# EasyEDA Pro project ProPrj_基于STM32的多功能串口分析仪_2025-03-12.epro, schematic H750_1

## Sheets
1 MUC: Board Name: V2.1.0_1; Create Date: 2025-02-20; Page Name: MUC; Project Name: 基于STM32的多功能串口分析仪; Schematic Name: H750_1; Update Date: 2025-03-08; Company: 嘉立创EDA; Page Size: A4; Version: V1.0
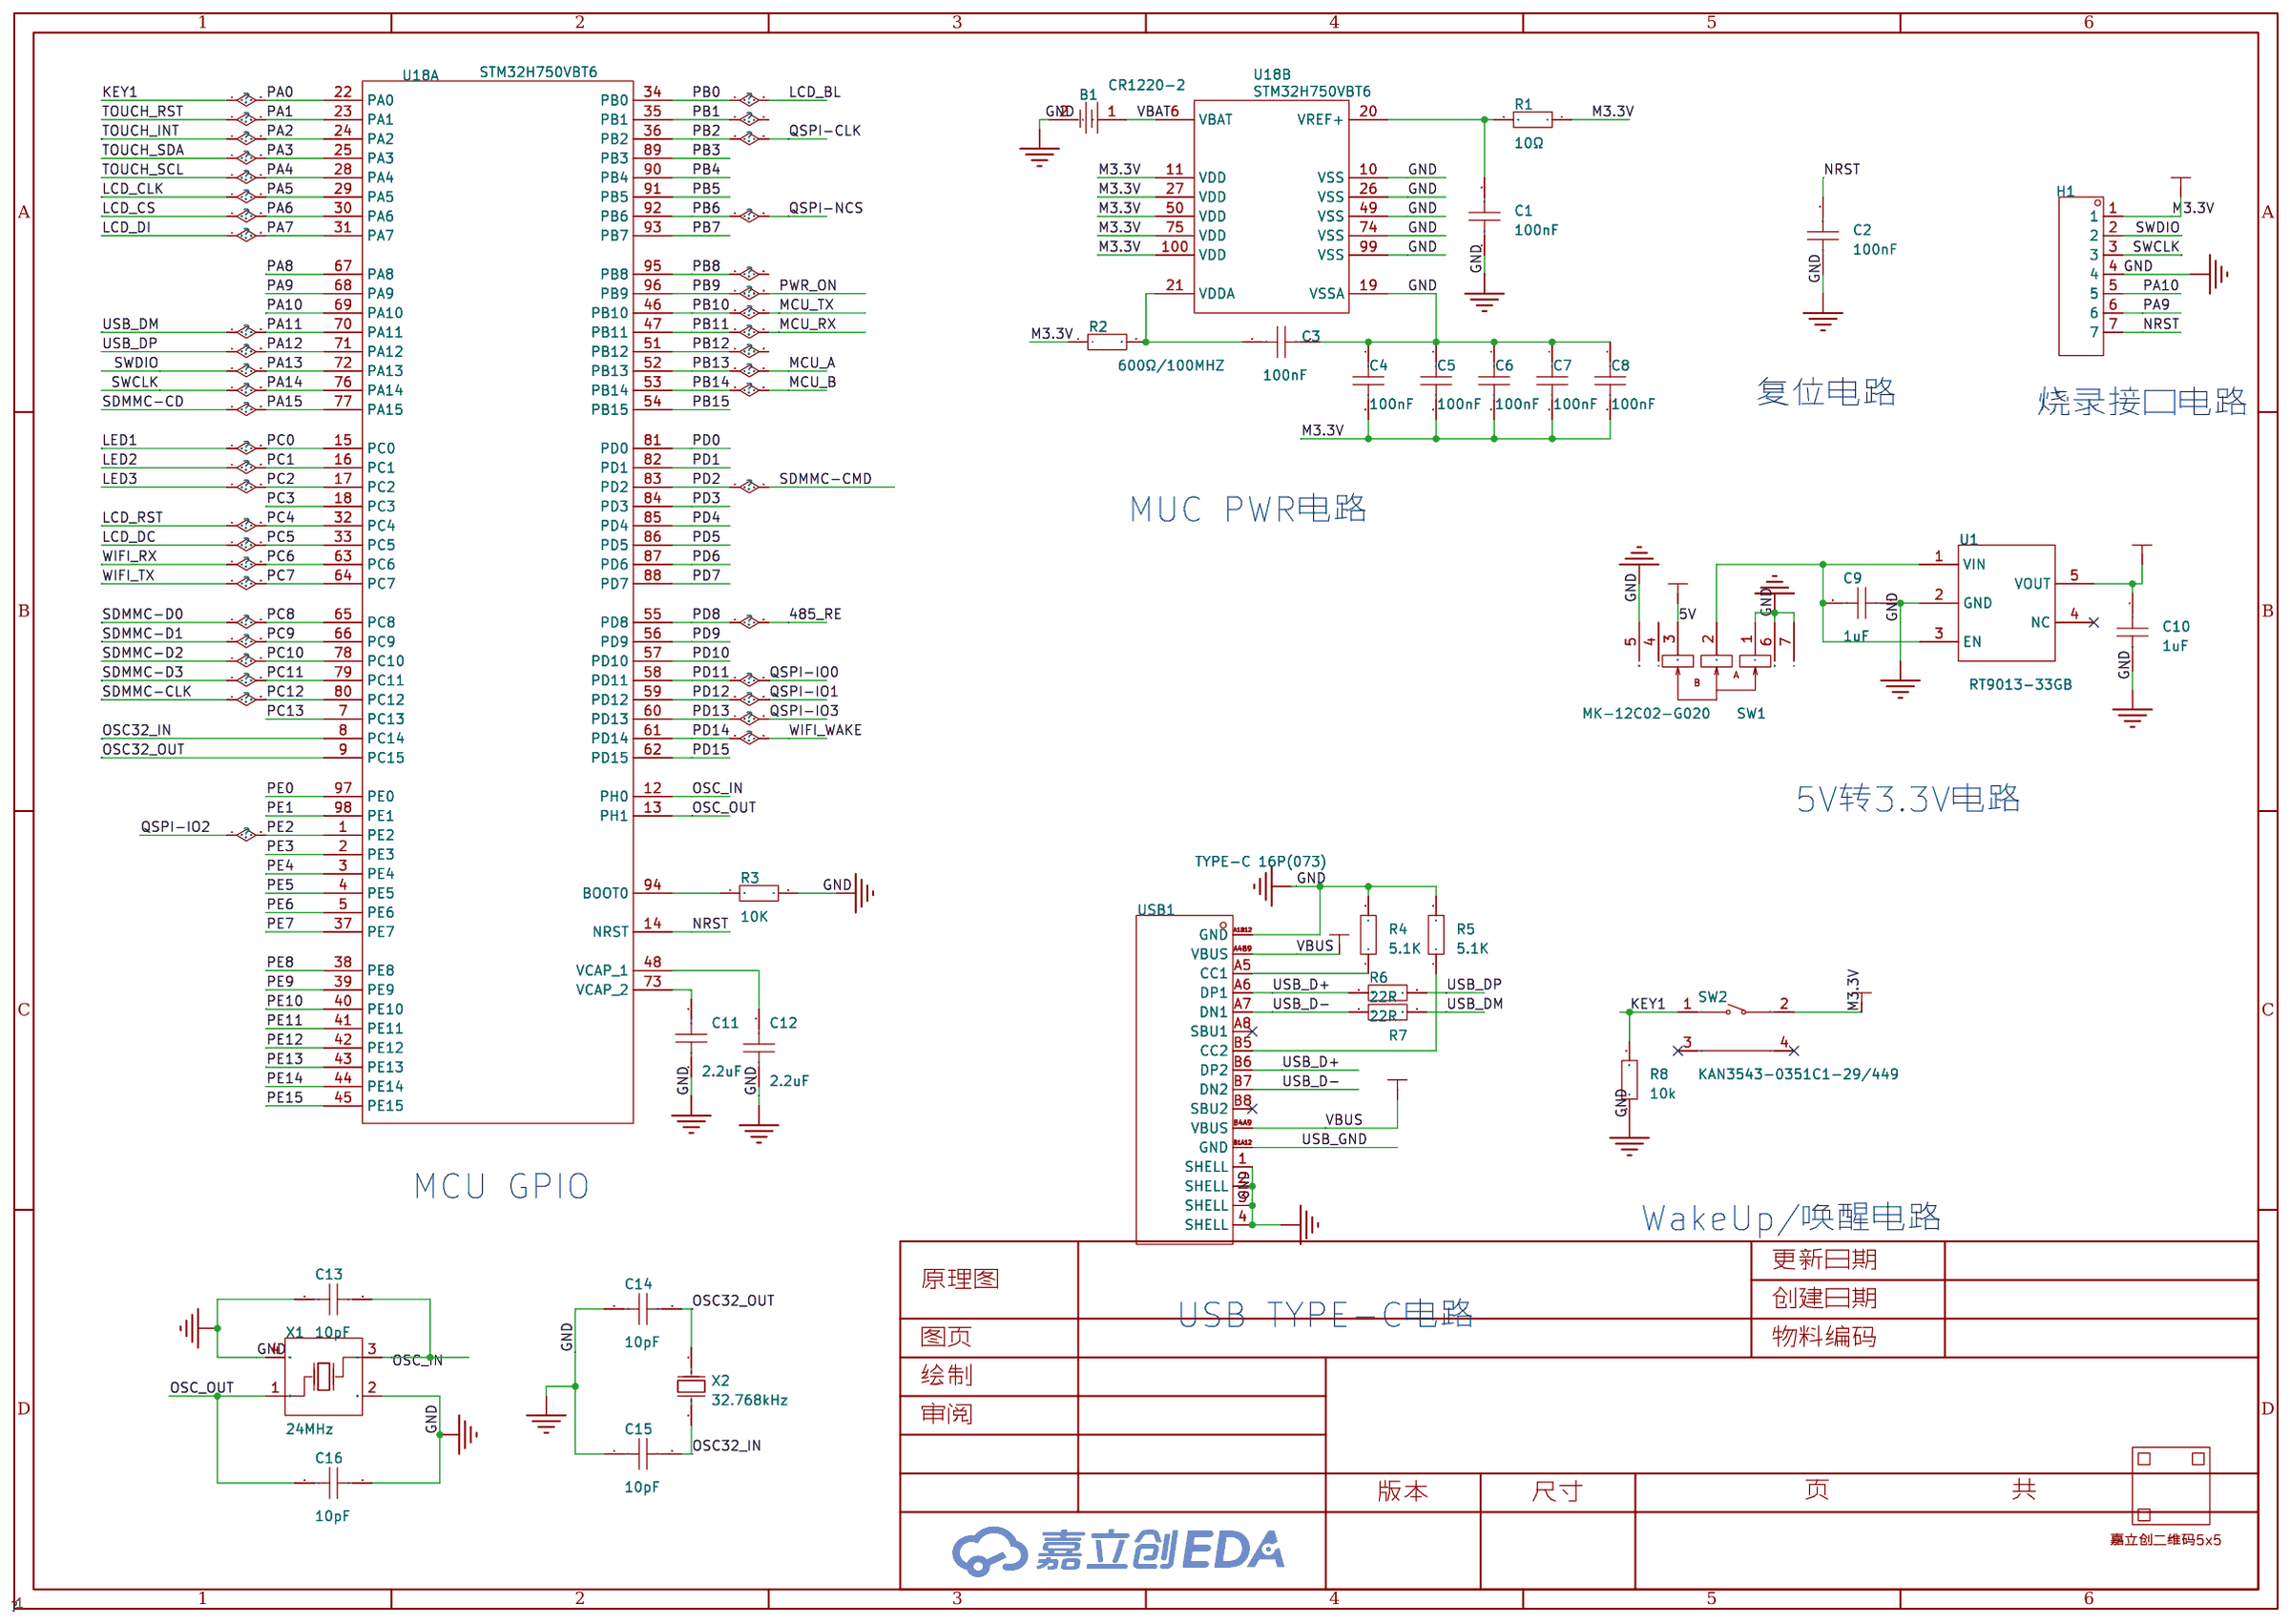
[diagram p3: MUC]
2 HardWare: Page Name: HardWare
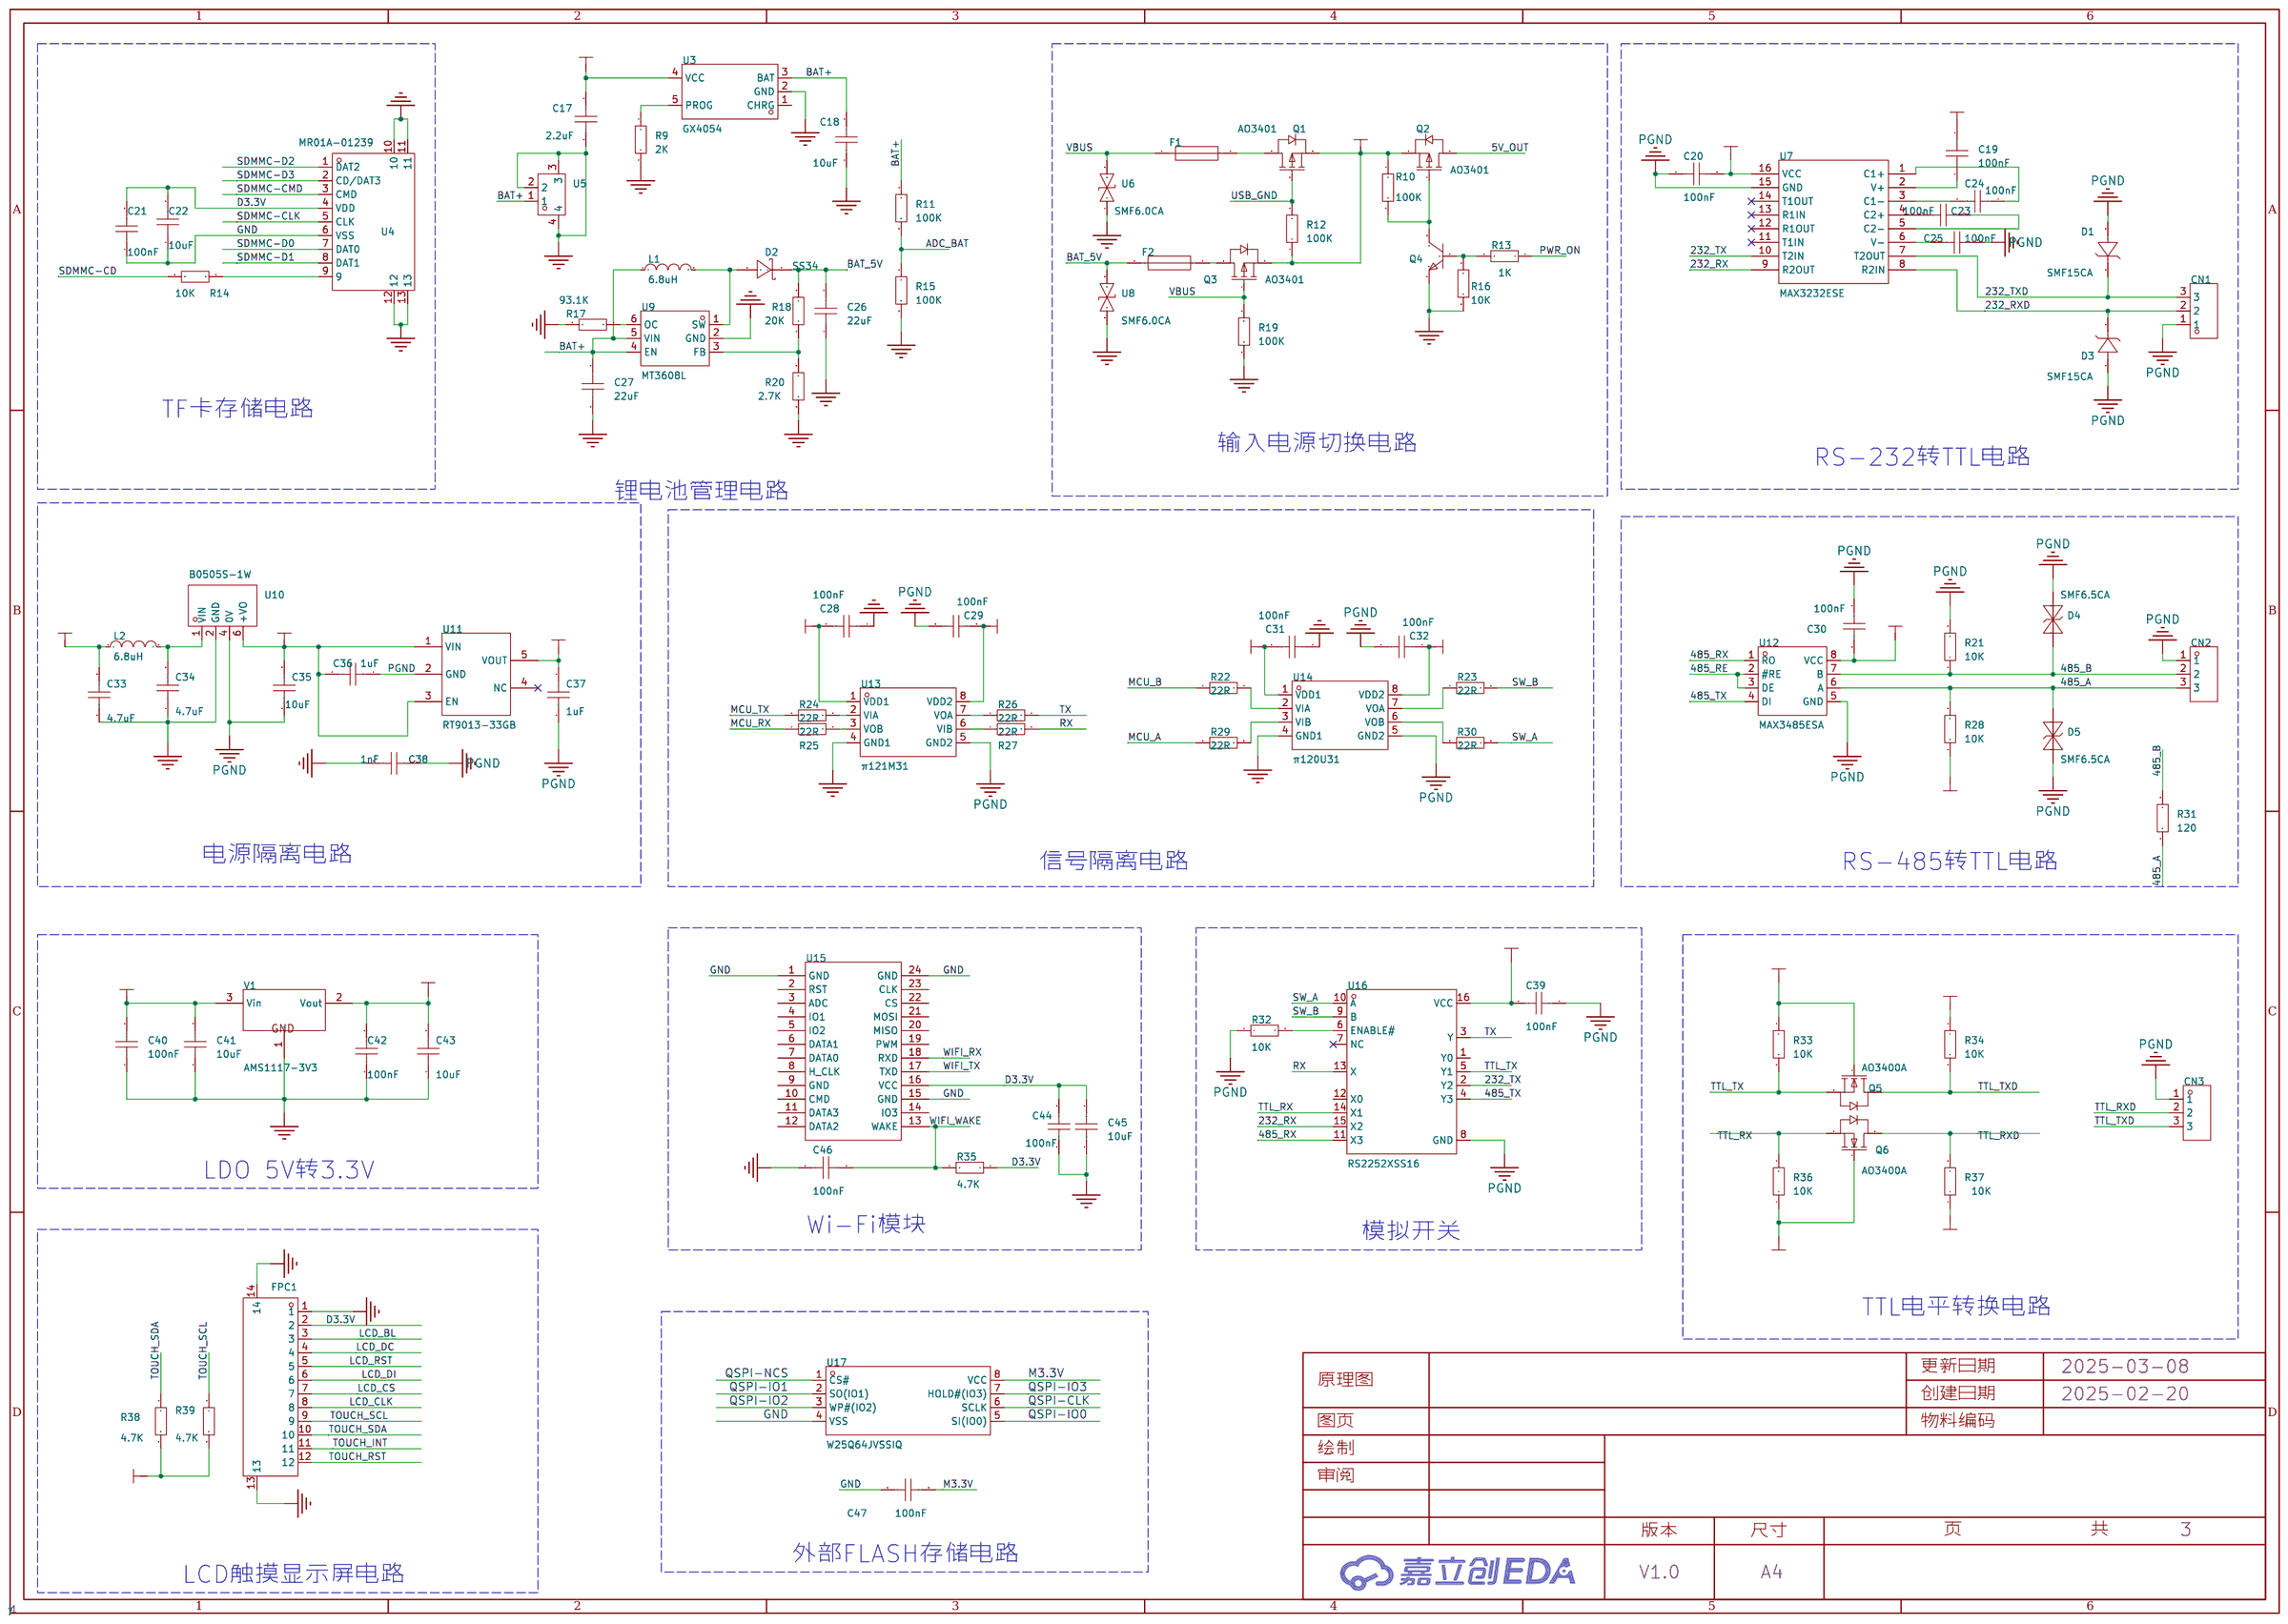
[diagram p4: HardWare]

## Parts
sheet HardWare
C17  2.2uF  [C0603]
C18  10uF  [C0603]
C19  100nF  [C0603]
C20  100nF  [C0603]
C21  100nF  [C0603]
C22  10uF  [C0603]
C23  100nF  [C0603]
C24  100nF  [C0603]
C25  100nF  [C0603]
C26  22uF  [C0805]
C27  22uF  [C0805]
C28  100nF  [C0603]
C29  100nF  [C0603]
C30  100nF  [C0603]
C31  100nF  [C0603]
C32  100nF  [C0603]
C33  4.7uF  [C0603]
C34  4.7uF  [C0603]
C35  10uF  [C0603]
C36  1uF  [C0603]
C37  1uF  [C0603]
C38  1nF  [C0603]
C39  100nF  [C0603]
C40  100nF  [C0603]
C41  10uF  [C0603]
C42  100nF  [C0603]
C43  10uF  [C0603]
C44  100nF  [C0603]
C45  10uF  [C0603]
C46  100nF  [C0603]
C47  100nF  [C0603]
CN1  DB2ERC-3.81-3P-GN  [CONN-TH_3P-P3.81_DB2ERC-3.81-3P]
CN2  DB2ERC-3.81-3P-GN  [CONN-TH_3P-P3.81_DB2ERC-3.81-3P]
CN3  DB2ERC-3.81-3P-GN  [CONN-TH_3P-P3.81_DB2ERC-3.81-3P]
D1  SMF15CA  [SOD-123FL_L2.7-W1.8-LS3.8-RD]
D2  SS34  [SMA_L4.3-W2.6-LS5.0-RD]
D3  SMF15CA  [SOD-123FL_L2.7-W1.8-LS3.8-RD]
D4  SMF6.5CA  [SOD-123FL_L2.7-W1.8-LS3.8-BI]
D5  SMF6.5CA  [SOD-123FL_L2.7-W1.8-LS3.8-BI]
F1  BSMD0805-010-33V  [F0805]
F2  BSMD0805-010-33V  [F0805]
FPC1  FPC-05F-12PH20  [FPC-SMD_12P-P0.50_FPC-05F-12PH20]
L1  6.8uH  [IND-SMD_L2.5-W2.0_FHD252010S-6R8MT]
L2  6.8uH  [IND-SMD_L2.5-W2.0_FHD252010S-6R8MT]
Q1  AO3401  [SOT-23-3_L2.9-W1.4-P1.90-LS2.6-BR]
Q2  AO3401  [SOT-23-3_L2.9-W1.4-P1.90-LS2.6-BR]
Q3  AO3401  [SOT-23-3_L2.9-W1.4-P1.90-LS2.6-BR]
Q4  -  [S8050_SOT-23]
Q5  AO3400A  [SOT-23-3_L2.9-W1.3-P1.90-LS2.4-BR]
Q6  AO3400A  [SOT-23-3_L2.9-W1.3-P1.90-LS2.4-BR]
R9  2K  [R0603]
R10  100K  [R0603]
R11  100K  [R0603]
R12  100K  [R0603]
R13  1K  [R0603]
R14  10K  [R0603]
R15  100K  [R0603]
R16  10K  [R0603]
R17  93.1K  [R0603]
R18  20K  [R0603]
R19  100K  [R0603]
R20  2.7K  [R0603]
R21  10K  [R0603]
R22  22R  [R0603]
R23  22R  [R0603]
R24  22R  [R0603]
R25  22R  [R0603]
R26  22R  [R0603]
R27  22R  [R0603]
R28  10K  [R0603]
R29  22R  [R0603]
R30  22R  [R0603]
R31  120  [R0603]
R32  10K  [R0603]
R33  10K  [R0603]
R34  10K  [R0603]
R35  4.7K  [R0603]
R36  10K  [R0603]
R37  10K  [R0603]
R38  4.7K  [R0603]
R39  4.7K  [R0603]
U3  GX4054  [SOT-23-5_L2.9-W1.6-P0.95-LS2.8-BR]
U4  MR01A-01239  [TF-SMD_MR01A-01211]
U5  ZX-XH2.54-2PLT  [BAT+]
U6  SMF6.0CA  [SOD-123FL_L2.8-W1.8-LS3.7-BI]
U7  MAX3232ESE  [SOIC-16_L9.9-W3.9-P1.27-LS6.0-BL]
U8  SMF6.0CA  [SOD-123FL_L2.8-W1.8-LS3.7-BI]
U9  MT3608L  [SOT-23-6_L2.9-W1.6-P0.95-LS2.8-BL_3]
U10  B0505S-1W  [PWRM-TH_B0505S-3WR2]
U11  RT9013-33GB  [SOT-23-5_L3.0-W1.7-P0.95-LS2.8-BL]
U12  MAX3485ESA  [SOP-8_L5.0-W4.0-P1.27-LS6.0-BL]
U13  π121M31  [SOIC-8_L5.0-W4.0-P1.27-LS6.0-BL]
U14  π120U31  [soic-8_l5.0-w4.0-p1.27-ls6.0-bl]
U15  -  [E103-W11]
U16  RS2252XSS16  [SSOP-16_L4.9-W3.9-P0.635-LS6.0-BL]
U17  W25Q64JVSSIQ  [SOP-8_L5.3-W5.3-P1.27-LS8.0-BL]
V1  AMS1117-3V3  [SOT89-3_HOUSING_REVA_02SEP2012]
sheet MUC
B1  CR1220-2  [BAT-SMD_CR1220-2]
C1  100nF  [C0603]
C2  100nF  [C0603]
C3  100nF  [C0603]
C4  100nF  [C0603]
C5  100nF  [C0603]
C6  100nF  [C0603]
C7  100nF  [C0603]
C8  100nF  [C0603]
C9  1uF  [C0603]
C10  1uF  [C0603]
C11  2.2uF  [C0603]
C12  2.2uF  [C0603]
C13  10pF  [C0603]
C14  10pF  [C0603]
C15  10pF  [C0603]
C16  10pF  [C0603]
H1  -  [HDR-TH_7P-P2.54-V-F]
R1  10Ω  [R0603]
R2  600Ω/100MHZ  [R0603]
R3  10K  [R0603]
R4  5.1K  [R0603]
R5  5.1K  [R0603]
R6  22R  [R0603]
R7  22R  [R0603]
R8  10k  [R0603]
SW1  MK-12C02-G020  [SW-SMD_MK-12C02-G020]
SW2  KAN3543-0351C1-29/449  [SW-SMD_GANGYUAN_KAN3543-0351C1]
U1  RT9013-33GB  [SOT-23-5_L3.0-W1.7-P0.95-LS2.8-BL]
U2  -  [JLC-QRCODE-5x5]
U18  STM32H750VBT6  [LQFP-100_L14.0-W14.0-P0.50-LS16.0-BL]  (sections 1,2)
USB1  TYPE-C 16P(073)  [USB-C-SMD_TYPE-C16PIN_C668624]
X1  24MHz  [CRYSTAL-SMD_4P-L3.2-W2.5-BL]
X2  32.768kHz  [CRYSTAL-SMD_L3.2-W1.5-1]

## Library data of the parts
C1-C25 C28-C47 = CAP_0603: Supplier Footprint: 0603
C26 C27 = CAP_0805: Supplier Footprint: 0805
CN1-CN3 = DB2ERC-3.81-3P-GN: 连接器类型:板端/插座-闭口;结构:1x3P;间距:3.81mm;颜色:绿色;安装方式:弯针;排数:1;每排PIN数:3;额定电流:10A;额定电压:250V;工作温度范围:-40℃~+105℃;; LCSC Part Name: 3.81mm 1x3P 排数:1 每排P数:3; Supplier Part: C395690; Manufacturer: DORABO(地博电气); Supplier Footprint: 弯插,P=3.81mm; Datasheet: https://atta.szlcsc.com/upload/public/pdf/source/20221115/4E217E7D538220F8720C137D6A05E519.pdf; Supplier: LCSC; Connector Type: 板端/插座-闭口; Structure: 1x3P; Pitch: 3.81mm; Color: 绿色; Mounting Style: 弯针; Number of Pins: 3P; Number of Rows: 1; Number of PINs Per Row: 3; Current Rating (Max): 10A; Voltage Rating (Max): 250V; Operating Temperature Range: -40℃~+105℃
D1 D3 = SMF16CA_C19077511: 极性:双向;反向截止电压(Vrwm):16V;最大钳位电压:26V;峰值脉冲电流(Ipp)@10/1000us:7.7A;峰值脉冲功率(Ppp)@10/1000us:200W;击穿电压:17.8V;; LCSC Part Name: SMF16CA; Supplier Part: C19077511; Manufacturer: 宏迦橙; Supplier Footprint: SOD-123FL; Datasheet: https://atta.szlcsc.com/upload/public/pdf/source/20231129/4813F17DC56F8B344A8D004597B3633C.pdf; Supplier: LCSC; polarity: 双向; Reverse Stand-Off Voltage (Vrwm): 16V; Maximum Clamping Voltage: 26V; Peak Pulse Current (Ipp)@10/1000us: 7.7A; Peak Pulse Power Dissipation (Ppp)@10/1000us: 200W; Breakdown Voltage: 17.8V; Reverse Leakage Current (Ir): 1uA; Number of Lines: 单路; Operating Temperature: -55℃~+155℃; Type: TVS
D2 = SS34: Supplier Part: C9900023345; Supplier Footprint: SMA,DO-214AC; JLCPCB Part Class: 扩展库; Supplier: LCSC
D4 D5 = SMF6.5CA_C19077501: 极性:双向;反向截止电压(Vrwm):6.5V;最大钳位电压:11.2V;峰值脉冲电流(Ipp)@10/1000us:17.9A;峰值脉冲功率(Ppp)@10/1000us:200W;击穿电压:7.22V;; Supplier Part: C19077501; Manufacturer: 宏迦橙; Supplier Footprint: SOD-123FL; Datasheet: https://atta.szlcsc.com/upload/public/pdf/source/20231201/BA209EB353689BD2A9785188AB9E10B0.pdf; Supplier: LCSC; polarity: 双向; Reverse Stand-Off Voltage (Vrwm): 6.5V; Maximum Clamping Voltage: 11.2V; Peak Pulse Current (Ipp)@10/1000us: 17.9A; Peak Pulse Power Dissipation (Ppp)@10/1000us: 200W; Breakdown Voltage: 7.22V; Reverse Leakage Current (Ir): 1uA; Number of Lines: 单路; Operating Temperature: -55℃~+155℃; Type: TVS
F1 F2 = BSMD0805-010-33V: 最大电压:33V;最大电流:40A;保持电流:100mA;跳闸电流:300mA;; LCSC Part Name: 0805 0.1A 33V 国产高电压; Supplier Part: C883101; Manufacturer: BHFUSE(佰宏); Supplier Footprint: 0805; Datasheet: https://atta.szlcsc.com/upload/public/pdf/source/20230512/7A46D6CD923C15CBB98FD769C08EDD80.pdf; Supplier: LCSC; Operating Voltage (Max): 33V; Current Rating (Max): 40A; Hold Current: 100mA; Trip Current: 300mA; Power Dissipation: 500mW; Resistance - Initial (Ri) (Min): 750mΩ; Resistance - Post Trip (R1) (Max): 6Ω; Maximum Time to Trip: 1.5s; Operating Temperature: -40℃~+85℃
FPC1 = FPC-05F-12PH20: 锁定特性:翻盖式;触点类型:下接;触点数量:12P;间距:0.5mm;安装类型:卧贴;工作温度范围:-25℃~+85℃;; LCSC Part Name: 间距:0.5mm P数:12P 翻盖式 下接; Supplier Part: C2856799; Manufacturer: XUNPU(讯普); Supplier Footprint: SMD,P=0.5mm,卧贴; Datasheet: https://atta.szlcsc.com/upload/public/pdf/source/20210922/C2856799_794322F63241F1C59819430844B946BA.pdf; Supplier: LCSC; Locking Feature: 翻盖式; Contact Type: 下接; Number of Contacts: 12P; Pitch: 0.5mm; Mounting Type: 卧贴; FFC, FCB Thickness: 0.3mm; Height Above Board: 2mm; Operating Temperature Range: -25℃~+85℃
L1 L2 = FHD252010S-6R8MT: 电感值:6.8uH;精度:±20%;额定电流:1A;饱和电流(Isat):1.15A;; LCSC Part Name: 6.8uH ±20% 1.15A; Supplier Part: C602006; Manufacturer: cjiang(长江微电); Supplier Footprint: 1008; Datasheet: https://atta.szlcsc.com/upload/public/pdf/source/20200609/C601990_BCEA243EC4DA0A9A288AA78A6DFB48A5.pdf; Supplier: LCSC; Tolerance: ±20%; Rated Current: 1A; Saturation Current (Isat): 1.15A; DC Resistance (DCR): 380mΩ
Q1-Q3 = AO3401_C727156: 类型:1个P沟道;漏源电压(Vdss):30V;连续漏极电流(Id):4.2A;功率(Pd):350mW;导通电阻(RDS(on)@Vgs,Id):65mΩ@10V,4.2A;阈值电压(Vgs(th)@Id):1.3V@250uA;; LCSC Part Name: 1个P沟道 耐压:30V 电流:4.2A; Supplier Part: C727156; Manufacturer: TWGMC(台湾迪嘉); Supplier Footprint: SOT-23; Datasheet: https://atta.szlcsc.com/upload/public/pdf/source/20200827/C727156_6E081BBEEFBC6B8FEE164CB196B0AF30.pdf; Supplier: LCSC; Type: 1个P沟道; Drain Source Voltage (Vdss): 30V; Continuous Drain Current (Id): 4.2A; Power Dissipation (Pd): 350mW; Drain Source On Resistance (RDS(on)@Vgs,Id): 65mΩ@10V,4.2A; Gate Threshold Voltage (Vgs(th)@Id): 1.3V@250uA
Q4 = S8050_SOT_NPN: Supplier Footprint: SOT-23
Q5 Q6 = AO3400A_C347475: 类型:1个N沟道;漏源电压(Vdss):30V;连续漏极电流(Id):5.8A;功率(Pd):1.4W;导通电阻(RDS(on)@Vgs,Id):35mΩ@10V,5.8A;阈值电压(Vgs(th)@Id):1.4V@250uA;; LCSC Part Name: 1个N沟道 耐压:30V 电流:5.8A; Supplier Part: C347475; Manufacturer: UMW(友台半导体); Supplier Footprint: SOT-23; Datasheet: https://atta.szlcsc.com/upload/public/pdf/source/20231109/50AB4FB4D66E55864F9B8D027B723C9A.pdf; Supplier: LCSC; Type: 1个N沟道; Drain Source Voltage (Vdss): 30V; Continuous Drain Current (Id): 5.8A; Power Dissipation (Pd): 1.4W; Drain Source On Resistance (RDS(on)@Vgs,Id): 35mΩ@10V,5.8A; Gate Threshold Voltage (Vgs(th)@Id): 1.4V@250uA; Total Gate Charge (Qg@Vgs): 12nC@4.5V; Input Capacitance (Ciss@Vds): 1.05nF@15V; Operating Temperature: -55℃~+150℃@(Tj)
R1-R39 = Res_0603: Supplier Footprint: 0603
U3 = GX4054: 最大充电电流:500mA;; Supplier Part: C5259235; Manufacturer: 国芯佳品; Supplier Footprint: SOT-23-5L; JLCPCB Part Class: 扩展库; Datasheet: https://atta.szlcsc.com/upload/public/pdf/source/20231117/282E3D86D21E4B74B8836E6CF123CD3A.pdf; Supplier: LCSC; Maximum Charge Current: 500mA
U4 = MR01A-01239: LCSC Part Name: MICRO SD CARD PUSH 外焊型 带锁卡功能 功能区镀金3u″锡脚镀雾纯锡至少160u″卷装; Supplier Part: C2891857; Manufacturer: ATOM(爱特姆); Supplier Footprint: SMD; Datasheet: https://atta.szlcsc.com/upload/public/pdf/source/20220228/F2FB385E664216F5F9F5E4078ECAFC8D.pdf; Supplier: LCSC
U5 = ZX-XH2.54-2PLT: 插针结构:1x2P;间距:2.54mm;安装方式:立贴;参考系列:XH;总PIN数:2P;排数:1;每排PIN数:2;行距:-;额定电流:3A;触头材质:黄铜;触头镀层:锡;工作温度范围:-25℃~+85℃;; Supplier Part: C7429680; Manufacturer: Megastar(兆星); Supplier Footprint: SMD,P=2.54mm; Datasheet: https://atta.szlcsc.com/upload/public/pdf/source/20230619/87C018EBE425F10E4B035B436CF5FBBC.pdf; Supplier: LCSC; Pins Structure: 1x2P; Pitch: 2.54mm; Mounting Style: 立贴; Reference Series: XH; Number of Pins: 2P; Number of Rows: 1; Number of PINs Per Row: 2; Current Rating (Max): 3A; Contact Material: 黄铜; Contact Plating: 锡; Operating Temperature Range: -25℃~+85℃
U6 U8 = SMF6.0CA_C2990473: 反向截止电压(Vrwm):6V;最大钳位电压:10.3V;峰值脉冲电流(Ipp)@10/1000us:19.4A;峰值脉冲功率(Ppp)@10/1000us:200W;击穿电压:6.67V;; Supplier Part: C2990473; Manufacturer: Liown(里阳半导体); Supplier Footprint: SOD-123FL; Datasheet: https://atta.szlcsc.com/upload/public/pdf/source/20231227/BBF9EE757846DE4D601D73FF261316E0.pdf; Supplier: LCSC; Reverse Stand-Off Voltage (Vrwm): 6V; Maximum Clamping Voltage: 10.3V; Peak Pulse Current (Ipp)@10/1000us: 19.4A; Peak Pulse Power Dissipation (Ppp)@10/1000us: 200W; Breakdown Voltage: 6.67V; Reverse Leakage Current (Ir): 400uA; Type: TVS
U7 = MAX3232ESE+T: 类型:收发器;驱动器/接收器:2/2;数据速率:250Kbps;; LCSC Part Name: 3.0V至5.5V、低功耗、1Mbps、真RS-232收发器; Supplier Part: C15846; Manufacturer: ADI(亚德诺)/MAXIM(美信); Supplier Footprint: SOIC-16; Datasheet: https://atta.szlcsc.com/upload/public/pdf/source/20220812/1D5DF2FF91750DFE63BD771071C0B1F6.pdf; Supplier: LCSC; Types: 收发器; Driver/receiver: 2/2; Data Rate: 250Kbps; Supply Voltage: 3V~5.5V; Operating Temperature: -40℃~+85℃
U9 = MT3608L: Supplier Part: C2932326; Manufacturer: 西安航天民芯; Supplier Footprint: SOT-23-6; Datasheet: https://atta.szlcsc.com/upload/public/pdf/source/20211213/953A62CC1033762E00AABAD4906DD7F1.pdf; Supplier: LCSC
U10 = B0505S-3WR2_C5369498: 支持100%全国产，B0505S-3WR2品是专门应用在分布式电源系统中需要产生一路与输入电源隔离的电源的应用场合而设计。该产品适用于：纯数字电路，一般低频模拟电路，继电器驱动电路，数据交换电路等输出电压15V，输出电流（mA）200，可持续 短路保护空载输入电流低至4mA效率高达85%低纹波系数和低噪音隔离电压 1500VDC国际标准引脚方式工作温度范围：-40℃ ~+105℃可根据客户需求设计特殊规格产品●; LCSC Part Name: DC-DC 输入电压4.5V~5.5V 输出电压5V输出功率3W600mA; Supplier Part: C5369498; Manufacturer: YLPTEC(易川); Supplier Footprint: SIP-4; Datasheet: https://atta.szlcsc.com/upload/public/pdf/source/20230417/78355FDB466A614ED9BF545F60A618F8.pdf; Supplier: LCSC
U1 U11 = RT9013-33GB: 输出类型:固定;最大输入电压:5.5V;输出电压:3.3V;最大输出电流:500mA;电源纹波抑制比(PSRR):50dB@(10kHz);输出极性:正极;; LCSC Part Name: 输入5.5V 输出3.3V 500mA; Supplier Part: C47773; Manufacturer: RICHTEK(立锜); Supplier Footprint: SOT-23-5; Datasheet: https://atta.szlcsc.com/upload/public/pdf/source/20150504/1457707282459.pdf; Supplier: LCSC; Output Type: 固定; Maximum Input Voltage: 5.5V; Output Voltage: 3.3V; MAX Output Current: 500mA; Power Supply Rejection Ratio (PSRR): 50dB@(10kHz); Dropout Voltage: 400mV@(500mA); standby current: 50uA; Operating Temperature: -40℃~+85℃; Output Polarity: 正极; Number of Outputs: 1
U12 = MAX3485ESA: 类型:收发器;数据速率:12Mbps;驱动器/接收器:1/1;; Supplier Part: C668204; Manufacturer: UMW(友台半导体); Supplier Footprint: SOP-8; Datasheet: https://atta.szlcsc.com/upload/public/pdf/source/20231109/DDD7CD3D891754087D6BC3897133907F.pdf; Supplier: LCSC; Types: 收发器; Supply Voltage: 2.97V~3.63V; Data Rate: 12Mbps; Driver/receiver: 1/1; Operating Temperature: -40℃~+85℃
U13 = π121M31: 应用:-;通道数:2;隔离电压(Viso):3000Vrms;隔离技术:-;; LCSC Part Name: 增强型ESD 3.0kVrms/6.0kVrms 10Mbps双通道数字隔离器; Supplier Part: C471593; Manufacturer: 2Pai Semi(荣湃); Supplier Footprint: SOIC-8; JLCPCB Part Class: 扩展库; Datasheet: https://atta.szlcsc.com/upload/public/pdf/source/20191223/C471593_84962F1DCE3F89542E7E78E419FA17BB.pdf; Supplier: LCSC; Voltage Isolation or Not: 带电压隔离; Supply Voltage: 3V~5.5V; Data Rate: 10Mbps; Number of Channels: 2; Isolation voltage: 3000Vrms; Forward Channel: 1; Reverse channel: 1
U14 = π120U31: 应用:通用;通道数:2;隔离电压(Viso):3000Vrms;隔离技术:-;; LCSC Part Name: 增强型ESD 3.0kVrms/6.0kVrms 150Kbps双通道数字隔离器; Supplier Part: C471588; Manufacturer: 2Pai Semi(荣湃); Supplier Footprint: SOIC-8; Datasheet: https://atta.szlcsc.com/upload/public/pdf/source/20191223/C471588_CD8CD4905F4DCC0F3407249B7C47B378.pdf; Supplier: LCSC; Applications: 通用; Voltage Isolation or Not: 带电压隔离; Supply Voltage: 3V~5.5V; Data Rate: 150Kbps; Number of Channels: 2; Isolation voltage: 3000Vrms; Forward Channel: 2; Reverse channel: 0
U15 = E103-W11
U16 = RS2252XSS16: Supplier Part: C5372470; Manufacturer: RUNIC(润石); Supplier Footprint: SSOP-16; JLCPCB Part Class: 扩展库; Datasheet: https://atta.szlcsc.com/upload/public/pdf/source/20230310/A3B66667A7FADAC60D2742739B00933D.pdf; Supplier: LCSC
U17 = GD25Q64ESIG: 存储容量:64Mbit;时钟频率(fc):133MHz;; Supplier Part: C2685734; Manufacturer: GigaDevice(兆易创新); Supplier Footprint: SOP-8-208mil; Datasheet: https://atta.szlcsc.com/upload/public/pdf/source/20210430/C2831359_BCFE71AD549651B3F601806E667453CB.pdf; Supplier: LCSC; Memory Size: 64Mbit; Clock Frequency (fc): 133MHz; Supply Voltage: 2.7V~3.6V; Operating Temperature: -40℃~+85℃
V1 = AMS1117-3V3: BOM名称: 稳压芯片; 版权归属: 源创客; 学习资源: www.ooocke.com
B1 = CR1220-2: 连接器类型:电池底座;适用电池规格:CR1220;工作温度范围:-;; LCSC Part Name: 电池底座 适用电池:CR1220; Supplier Part: C70381; Manufacturer: Q&J; Supplier Footprint: SMD; Datasheet: https://atta.szlcsc.com/upload/public/pdf/source/20160427/1461725216696.pdf; Supplier: LCSC; Connector Type: 电池底座; Battery Type: CR1220
H1 = HDR-F_2.54_1x7P: Supplier Part: C124418; Supplier Footprint: 插件
SW1 = MK-12C02-G020: 电路结构:单刀双掷;安装方式:卧贴;开关颜色:黑色;额定电流(DC):1A;额定电压(DC):6V;机械寿命:1万次;; LCSC Part Name: 微型拨动开关; Supplier Part: C963206; Manufacturer: G-Switch(品赞); Supplier Footprint: SMD; Datasheet: https://atta.szlcsc.com/upload/public/pdf/source/20200902/C778186_2AF08473ED98414D93A175E8814EEFA6.pdf; Supplier: LCSC; Circuit: 单刀双掷; Actuator Style: 矩形柱状; Pin Style: SMD接片; Switch Length: 6.6mm; Switch Width: 2.7mm; Switch Height: 4.7mm; Mounting Style: 卧贴; Actuator Color: 黑色; Current Rating (DC): 1A; Voltage Rating (DC): 6V; Mechanical Life: 1万次; Operating Temperature: -20℃~+70℃
SW2 = KAN3543-0351C1-29/449: 电路结构:单刀单掷;按钮形状:矩形按钮;作用力:2.6N;安装方式:卧贴;开关高度:3.5mm;触点电流:50mA;额定电压(DC):12V;绝缘电阻:100MΩ;机械寿命:3万次;; Supplier Part: C2831427; Manufacturer: GANGYUAN(港源); Supplier Footprint: SMD; Datasheet: https://atta.szlcsc.com/upload/public/pdf/source/20210526/C2831427_1BB177930EAB581A68E6D6C4FFB7141F.pdf; Supplier: LCSC; Circuit: 单刀单掷; Actuator Style: 矩形按钮; Operating Force: 2.6N; Mounting Style: 卧贴; Switch Height: 3.5mm; Contact Current: 50mA; Voltage Rating (DC): 12V; Insulation Resistance: 100MΩ; Actuator/Cap Color: 黑色; Pin Style: SMD接片; Mechanical Life: 3万次; Operating Temperature: -20℃~+70℃
U2 = 嘉立创二维码5x5
U18 = STM32H750VBT6: Supplier Part: C117815; Supplier: LCSC; Manufacturer: STMicroelectronics; Manufacturer Part: STM32F427VGT6
USB1 = TYPE-C 16P(073): 连接器类型:Type-C;标准:USB 3.1;公母:母;安装方式:卧贴;触点数量:16P;端口数量:1;额定电流 - 电源:5A;工作温度范围:-25℃~+85℃;; LCSC Part Name: Type-C 母 卧贴; Supplier Part: C668624; Manufacturer: SHOU HAN(首韩); Supplier Footprint: SMD; Datasheet: https://atta.szlcsc.com/upload/public/pdf/source/20200618/C668624_CC51EC37614090AAD56C1421DE954C80.pdf; Supplier: LCSC; Connector Type: Type-C; Standard: USB 3.1; Gender: 母; Mounting Style: 卧贴; Number of Contacts: 16P; Number of Ports: 1; Current Rating - Power (Max): 5A; Operating Temperature Range: -25℃~+85℃; Rated Voltage (Max): 5V; Connect-Disconnect Life: 1万次; Core Colour: 黑色
X1 = X322524MOB4SI: 晶振类型:贴片晶振;频率:24MHz;常温频差:±10ppm;外接负载电容:12pF;频率稳定度(全温):±20ppm;; LCSC Part Name: 24MHz ±10ppm 12pF; Supplier Part: C70590; Manufacturer: YXC(扬兴晶振); Supplier Footprint: SMD3225-4P; JLCPCB Part Class: Extended Part; Datasheet: https://atta.szlcsc.com/upload/public/pdf/source/20240329/19D5F850207469550BEB00D7DFEDBC7A.pdf; Supplier: LCSC; Crystal Type: 贴片晶振; Normal temperature Frequency Tolerance: ±10ppm; External load capacitor: 12pF; Frequency Stability(Full temperature range): ±20ppm; Operating Temperature: -40℃~+85℃
X2 = XKXGI-SUA-32.768K: 晶振类型:贴片晶振;频率:32.768kHz;常温频差:±20ppm;外接负载电容:12.5pF;频率稳定度(全温):±30ppm;; LCSC Part Name: 32.768kHz ±20ppm 12.5pF YST310S; Supplier Part: C5213671; Manufacturer: YXC(扬兴晶振); Supplier Footprint: SMD3215-2P; Datasheet: https://atta.szlcsc.com/upload/public/pdf/source/20240329/3A7650FD985DD0DE85694D3785AB4916.pdf; Supplier: LCSC; Crystal Type: 贴片晶振; Normal temperature Frequency Tolerance: ±20ppm; External load capacitor: 12.5pF; Frequency Stability(Full temperature range): ±30ppm; Operating Temperature: -40℃~+85℃

## Nets
5V: Q1.2(S) Q2.2(S) Q3.2(S) R10.1 R12.1 SW1.3
5V_OUT: C33.2 C40.2 C41.2 L2.1 Q2.3(D) V1.3(Vin)
D3.3V: C21.2 C22.2 C28.2 C31.2 C42.2 C43.2 C44.2 C45.2 FPC1.2 R35.1 R38.2 R39.2 U4.4(VDD) U13.1(VDD1) U14.1(VDD1) U15.16(VCC) V1.2(Vout)
GND: B1.2 C1.2 C2.1 C3.1 C4.1 C5.1 C6.1 C7.1 C8.1 C9.1 C10.2 C11.1 C12.1 C13.1 C14.1 C15.1 C16.2 C17.1 C18.1 C21.1 C22.1 C26.1 C27.1 C28.1 C31.1 C33.1 C34.1 C38.1 C40.1 C41.1 C42.1 C43.1 C44.1 C45.1 C46.2 C47.2 FPC1.1 FPC1.13 FPC1.14 H1.4 Q4.2 R3.2 R4.2 R5.2 R8.1 R9.2 R15.2 R16.2 R17.1 R19.2 R20.1 SW1.1 SW1.5 SW1.6 SW1.7 U1.2(GND) U3.2(GND) U4.6(VSS) U4.10 U4.11 U4.12 U4.13 U5.2 U5.3 U5.4 U6.1 U8.1 U9.2(GND) U10.2(GND) U13.4(GND1) U14.4(GND1) U15.1(GND) U15.15(GND) U15.24(GND) U17.4(VSS) U18.10(VSS) U18.19(VSSA) U18.26(VSS) U18.49(VSS) U18.74(VSS) U18.99(VSS) USB1.1(SHELL) USB1.2(SHELL) USB1.3(SHELL) USB1.4(SHELL) USB1.A1B12(GND) V1.1(GND) X1.2(GND) X1.4(GND)
PGND: C20.1 C25.1 C29.2 C30.1 C32.2 C35.1 C36.1 C37.2 C38.2 C39.1 CN1.1 CN2.1 CN3.1 D1.2(A) D3.2(A) D4.1 D5.1 R21.2 R32.1 U7.15(GND) U10.4(0V) U11.2(GND) U12.5(GND) U13.5(GND2) U14.5(GND2) U16.8(GND)
PVDD: C19.2 C20.2 C29.1 C30.2 C32.1 C37.1 C39.2 Q5.1(G) Q6.1(G) R28.1 R33.1 R36.1 U7.16(VCC) U11.5(VOUT) U12.8(VCC) U13.8(VDD2) U14.8(VDD2) U16.16(VCC)
VBAT: B1.1 U18.6(VBAT)
VBUS: C17.2 F1.1 Q3.1(G) R19.1 U3.4(VCC) U6.2 USB1.A4B9(VBUS) USB1.B4A9(VBUS)
232_RX: U7.9(R2OUT) U16.15(X2)
232_RXD: CN1.2 D3.1(K) U7.8(R2IN)
232_TX: U7.10(T2IN) U16.2(Y2)
232_TXD: CN1.3 D1.1(K) U7.7(T2OUT)
485_A: CN2.3 D5.2 R28.2 R31.1 U12.6(A)
485_B: CN2.2 D4.2 R21.1 R31.2 U12.7(B)
485_RE: U12.2(#RE) U12.3(DE) U18.55(PD8)
485_RX: U12.1(RO) U16.11(X3)
485_TX: U12.4(DI) U16.4(Y3)
ADC_BAT: R11.2 R15.1
BAT+: C18.2 C27.2 L1.1 R11.1 U3.3(BAT) U5.1 U9.4(EN) U9.5(VIN)
BAT_5V: C26.2 D2.1(K) F2.1 R18.2 U8.2
KEY1: R8.2 SW2.1 U18.22(PA0)
LCD_BL: FPC1.3 U18.34(PB0)
LCD_CLK: FPC1.8 U18.29(PA5)
LCD_CS: FPC1.7 U18.30(PA6)
LCD_DC: FPC1.4 U18.33(PC5)
LCD_DI: FPC1.6 U18.31(PA7)
LCD_RST: FPC1.5 U18.32(PC4)
LED1: U18.15(PC0)
LED2: U18.16(PC1)
LED3: U18.17(PC2)
M3.3V: C4.2 C5.2 C6.2 C7.2 C8.2 C10.1 C47.1 H1.1 R1.1 R2.1 SW2.2 U1.5(VOUT) U17.8(VCC) U18.11(VDD) U18.27(VDD) U18.50(VDD) U18.75(VDD) U18.100(VDD)
MCU_A: R29.1 U18.52(PB13)
MCU_B: R22.1 U18.53(PB14)
MCU_RX: R25.1 U18.47(PB11)
MCU_TX: R24.1 U18.46(PB10)
NRST: C2.2 H1.7 U18.14(NRST)
OSC32_IN: C15.2 U18.8(PC14) X2.2(OSC2)
OSC32_OUT: C14.2 U18.9(PC15) X2.1(OSC1)
OSC_IN: C13.2 U18.12(PH0) X1.3(OSC2)
OSC_OUT: C16.1 U18.13(PH1) X1.1(OSC1)
P_5V: C35.2 C36.2 R34.1 R37.1 U10.6(+VO) U11.1(VIN) U11.3(EN)
PA1: FPC1.12 U18.23(PA1)
PA2: FPC1.11 U18.24(PA2)
PA3: FPC1.10 R38.1 U18.25(PA3)
PA4: FPC1.9 R39.1 U18.28(PA4)
PA8: U18.67(PA8)
PA9: H1.6 U18.68(PA9)
PA10: H1.5 U18.69(PA10)
PA11: R7.2 U18.70(PA11)
PA12: R6.2 U18.71(PA12)
PA13: H1.2 U18.72(PA13)
PA14: H1.3 U18.76(PA14)
PA15: R14.1 U18.77(PA15)
PB1: U18.35(PB1)
PB2: U17.6(SCLK) U18.36(PB2)
PB3: U18.89(PB3)
PB4: U18.90(PB4)
PB5: U18.91(PB5)
PB6: U17.1(CS#) U18.92(PB6)
PB7: U18.93(PB7)
PB8: U18.95(PB8)
PB9: R13.1 U18.96(PB9)
PB12: U18.51(PB12)
PB15: U18.54(PB15)
PC3: U18.18(PC3)
PC6: U15.18(RXD) U18.63(PC6)
PC7: U15.17(TXD) U18.64(PC7)
PC8: U4.7(DAT0) U18.65(PC8)
PC9: U4.8(DAT1) U18.66(PC9)
PC10: U4.1(DAT2) U18.78(PC10)
PC11: U4.2(CD/DAT3) U18.79(PC11)
PC12: U4.5(CLK) U18.80(PC12)
PC13: U18.7(PC13)
PD0: U18.81(PD0)
PD1: U18.82(PD1)
PD2: U4.3(CMD) U18.83(PD2)
PD3: U18.84(PD3)
PD4: U18.85(PD4)
PD5: U18.86(PD5)
PD6: U18.87(PD6)
PD7: U18.88(PD7)
PD9: U18.56(PD9)
PD10: U18.57(PD10)
PD11: U17.5(SI(IO0)) U18.58(PD11)
PD12: U17.2(SO(IO1)) U18.59(PD12)
PD13: U17.7(HOLD#(IO3)) U18.60(PD13)
PD14: C46.1 R35.2 U15.13(WAKE) U18.61(PD14)
PD15: U18.62(PD15)
PE0: U18.97(PE0)
PE1: U18.98(PE1)
PE2: U17.3(WP#(IO2)) U18.1(PE2)
PE3: U18.2(PE3)
PE4: U18.3(PE4)
PE5: U18.4(PE5)
PE6: U18.5(PE6)
PE7: U18.37(PE7)
PE8: U18.38(PE8)
PE9: U18.39(PE9)
PE10: U18.40(PE10)
PE11: U18.41(PE11)
PE12: U18.42(PE12)
PE13: U18.43(PE13)
PE14: U18.44(PE14)
PE15: U18.45(PE15)
RX: R27.2 U16.13(X)
SW_A: R30.2 U16.10(A)
SW_B: R23.2 U16.9(B)
TTL_RX: Q6.2(S) R36.2 U16.14(X1)
TTL_RXD: CN3.2 Q6.3(D) R37.2
TTL_TX: Q5.2(S) R33.2 U16.5(Y1)
TTL_TXD: CN3.3 Q5.3(D) R34.2
TX: R26.2 U16.3(Y)
USB_D+: R6.1 USB1.A6(DP1) USB1.B6(DP2)
USB_D-: R7.1 USB1.A7(DN1) USB1.B7(DN2)
USB_GND: Q1.1(G) R12.2 USB1.B1A12(GND)
$1N1483: R3.1 U18.94(BOOT0)
$1N1691: C11.2 U18.73(VCAP_2)
$1N1747: C12.2 U18.48(VCAP_1)
$1N2666: C3.2 R2.2 U18.21(VDDA)
$1N2790: C1.1 R1.2 U18.20(VREF+)
$1N5326: R4.1 USB1.A5(CC1)
$1N5343: R5.1 USB1.B5(CC2)
$1N15715: C9.2 SW1.2 U1.1(VIN) U1.3(EN)
$2N1784: C34.2 L2.2 U10.1(VIN)
$2N3676: F2.2 Q3.3(D)
$2N3681: F1.2 Q1.3(D)
$2N4816: C24.2 U7.3(C1-)
$2N4817: C23.2 U7.4(C2+)
$2N4818: C23.1 U7.5(C2-)
$2N4819: C25.2 U7.6(V-)
$2N4832: C24.1 U7.1(C1+)
$2N4833: C19.1 U7.2(V+)
$2N6743: R22.2 U14.2(VIA)
$2N6746: R29.2 U14.3(VIB)
$2N6747: R23.1 U14.7(VOA)
$2N6750: R30.1 U14.6(VOB)
$2N7260: R24.2 U13.2(VIA)
$2N7292: R25.2 U13.3(VOB)
$2N7323: R26.1 U13.7(VOA)
$2N7355: R27.1 U13.6(VIB)
$2N11928: R14.2 U4.9
$2N21888: Q4.1 R13.2 R16.1
$2N28440: Q2.1(G) Q4.3 R10.2
$2N39094: D2.2(A) L1.2 U9.1(SW)
$2N39097: R18.1 R20.2 U9.3(FB)
$2N39101: R17.2 U9.6(OC)
$2N39122: R9.1 U3.5(PROG)
$2N41337: R32.2 U16.6(ENABLE#)

Not connected (* = marked no-connect by the designer): SW1 4; SW2 3* 4*; U1 4(NC)*; U3 1(CHRG); U7 11(T1IN)* 12(R1OUT)* 13(R1IN)* 14(T1OUT)*; U11 4(NC)*; U15 2(RST) 3(ADC) 4(IO1) 5(IO2) 6(DATA1) 7(DATA0) 8(H_CLK) 9(GND) 10(CMD) 11(DATA3) 12(DATA2) 14(IO3) 19(PWM) 20(MISO) 21(MOSI) 22(CS) 23(CLK); U16 1(Y0) 7(NC)* 12(X0); USB1 A8(SBU1)* B8(SBU2)*

## Notes on the sheets
sheet 1
- 复位电路
- 烧录接口电路
- MUC PWR电路
- 5V转3.3V电路
- MCU GPIO
- WakeUp/唤醒电路
- USB TYPE-C电路
sheet 2
- TF卡存储电路
- 输入电源切换电路
- RS-232转TTL电路
- 锂电池管理电路
- 电源隔离电路
- 信号隔离电路
- RS-485转TTL电路
- LDO 5V转3.3V
- Wi-Fi模块
- 模拟开关
- TTL电平转换电路
- 外部FLASH存储电路
- LCD触摸显示屏电路
